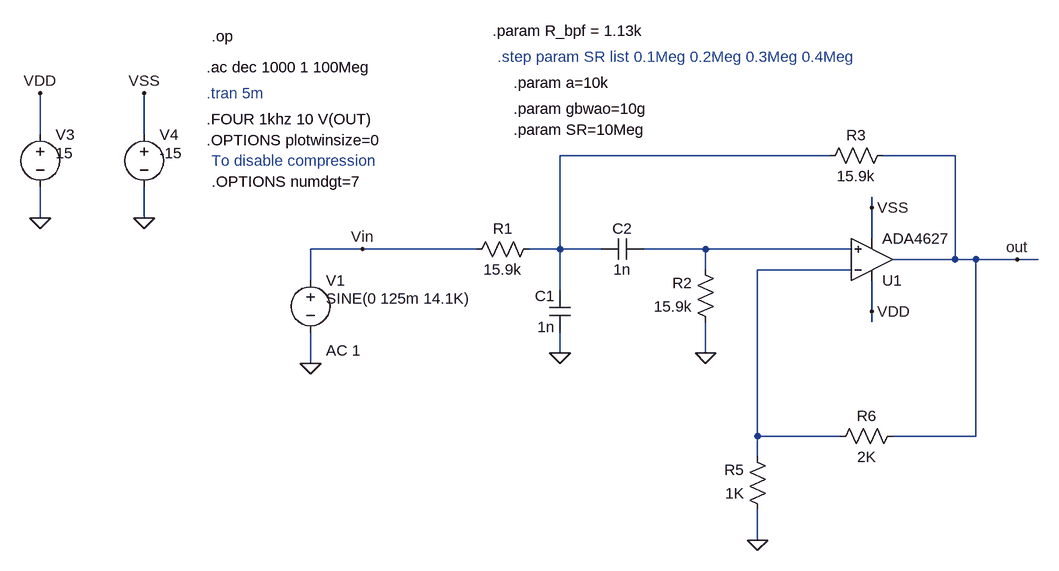
[diagram p0: schematic Etaj2-proiect AC.asc]
Etaj2-proiect AC.asc, the LTspice schematic file:
Version 4
SHEET 1 2932 1708
WIRE 1088 -16 1088 -80
WIRE 1248 -16 1248 -80
WIRE 2304 16 1888 16
WIRE 2496 16 2384 16
WIRE 2368 96 2368 80
WIRE 1088 112 1088 64
WIRE 1248 112 1248 64
WIRE 2368 144 2368 96
WIRE 1584 160 1504 160
WIRE 1760 160 1584 160
WIRE 1888 160 1888 16
WIRE 1888 160 1840 160
WIRE 1952 160 1888 160
WIRE 2112 160 2016 160
WIRE 2336 160 2112 160
WIRE 2496 176 2496 16
WIRE 2496 176 2400 176
WIRE 2528 176 2496 176
WIRE 2592 176 2528 176
WIRE 2624 176 2592 176
WIRE 2112 192 2112 160
WIRE 2336 192 2192 192
WIRE 1504 208 1504 160
WIRE 1888 224 1888 160
WIRE 2368 256 2368 208
WIRE 2368 272 2368 256
WIRE 1888 320 1888 288
WIRE 2112 320 2112 272
WIRE 1504 336 1504 288
WIRE 2192 448 2192 192
WIRE 2320 448 2192 448
WIRE 2528 448 2528 176
WIRE 2528 448 2400 448
WIRE 2192 480 2192 448
WIRE 2192 608 2192 560
FLAG 1088 112 0
FLAG 1248 112 0
FLAG 1088 -80 VDD
FLAG 1248 -80 VSS
FLAG 1504 336 0
FLAG 2592 176 out
FLAG 2368 96 VSS
FLAG 2368 256 VDD
FLAG 1584 160 Vin
FLAG 2112 320 0
FLAG 1888 320 0
FLAG 2192 608 0
DATAFLAG 1664 160 ""
DATAFLAG 1920 160 ""
DATAFLAG 2192 160 ""
DATAFLAG 2272 192 ""
DATAFLAG 2464 176 ""
SYMBOL voltage 1088 -32 R0
WINDOW 123 24 124 Left 2
WINDOW 39 0 0 Left 2
WINDOW 3 24 44 Left 2
SYMATTR Value 15
SYMATTR InstName V3
SYMBOL voltage 1248 -32 R0
WINDOW 123 24 124 Left 2
WINDOW 39 0 0 Left 2
WINDOW 3 24 44 Left 2
SYMATTR Value -15
SYMATTR InstName V4
SYMBOL voltage 1504 192 R0
WINDOW 123 24 124 Left 2
WINDOW 39 0 0 Left 2
WINDOW 3 24 44 Left 2
SYMATTR Value2 AC 1
SYMATTR Value SINE(0 125m 14.1K)
SYMATTR InstName V1
SYMBOL cap 1904 224 M0
SYMATTR InstName C1
SYMATTR Value 1n
SYMBOL res 1856 144 R90
WINDOW 0 0 56 VBottom 2
WINDOW 3 32 56 VTop 2
SYMATTR InstName R1
SYMATTR Value 15.9k
SYMBOL res 2128 288 R180
WINDOW 0 36 76 Left 2
WINDOW 3 36 40 Left 2
SYMATTR InstName R2
SYMATTR Value 15.9k
SYMBOL cap 1952 176 R270
WINDOW 0 32 32 VTop 2
WINDOW 3 0 32 VBottom 2
SYMATTR InstName C2
SYMATTR Value 1n
SYMBOL res 2400 0 R90
WINDOW 0 0 56 VBottom 2
WINDOW 3 32 56 VTop 2
SYMATTR InstName R3
SYMATTR Value 15.9k
SYMBOL res 2416 432 R90
WINDOW 0 0 56 VBottom 2
WINDOW 3 32 56 VTop 2
SYMATTR InstName R6
SYMATTR Value 2K
SYMBOL res 2208 576 R180
WINDOW 0 36 76 Left 2
WINDOW 3 36 40 Left 2
SYMATTR InstName R5
SYMATTR Value 1K
SYMBOL OpAmps\\ADA4627 2368 240 M180
SYMATTR InstName U1
TEXT 1344 -120 Left 2 !.ac dec 1000 1 100Meg
TEXT 1352 -168 Left 2 !.op
TEXT 1344 -80 Left 2 ;.tran 5m
TEXT 1816 -96 Left 2 !.param a=10k
TEXT 1816 -56 Left 2 !.param gbwao=10g
TEXT 1816 -24 Left 2 !.param SR=10Meg
TEXT 1344 -40 Left 2 !.FOUR 1khz 10 V(OUT)
TEXT 1344 -8 Left 2 !.OPTIONS plotwinsize=0
TEXT 1352 24 Left 2 ;To disable compression
TEXT 1352 56 Left 2 !.OPTIONS numdgt=7
TEXT 1792 -136 Left 2 ;.step param SR list 0.1Meg 0.2Meg 0.3Meg 0.4Meg
TEXT 1784 -176 Left 2 !.param R_bpf = 1.13k

The netlist it stands for:
* Etaj2-proiect AC.asc
V3 VDD 0 15
V4 VSS 0 -15
V1 Vin 0 SINE(0 125m 14.1K) AC 1
C1 N001 0 1n
R1 N001 Vin 15.9k
R2 0 N002 15.9k
C2 N001 N002 1n
R3 out N001 15.9k
R6 out N003 2K
R5 0 N003 1K
XU1 N002 N003 VDD VSS out ADA4627  ; pins In+ In- V+ V- OUT
.ac dec 1000 1 100Meg
.op
* .tran 5m
.param a=10k
.param gbwao=10g
.param SR=10Meg
.FOUR 1khz 10 V(OUT)
.OPTIONS plotwinsize=0
* To disable compression
.OPTIONS numdgt=7
* .step param SR list 0.1Meg 0.2Meg 0.3Meg 0.4Meg
.param R_bpf = 1.13k
.backanno
.end